# EAGLE schematic indicator_lights (EAGLE 7.2.0)
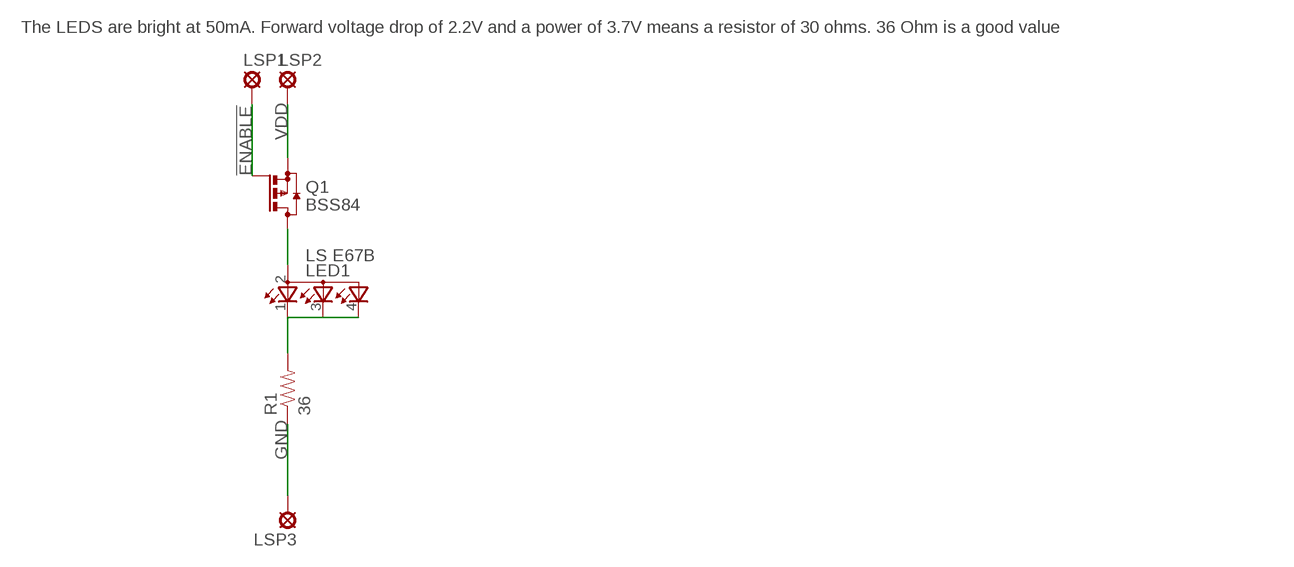
[diagram p0: schematic, sheet 1]

## Parts
LED1  LS E67B  TOPLED-3  [P-LCC-4-3]
LSP1  MCS10B  [MCS10B]
LSP2  MCS10B  [MCS10B]
LSP3  MCS10B  [MCS10B]
Q1  BSS84  [SOT23]
R1  36  RESISTOR0603-RES  [0603-RES]

## Nets
!ENABLE: LSP1.MP Q1.1(G)
GND: LSP3.MP R1.1
N$1: LED1.2(A2) Q1.3(D)
N$2: LED1.1(CRED) LED1.3(CBLUE) LED1.4(CGREEN) R1.2
VDD: LSP2.MP Q1.2(S)

## Notes on the sheet
- The LEDS are bright at 50mA. Forward voltage drop of 2.2V and a power of 3.7V means a resistor of 30 ohms. 36 Ohm is a good value

## Library data of the parts
LED1 = led:TOPLED-3: OSRAM - Hyper Multi TOPLED® (RGB) LB E673, LV E673, LT E673 - Power TOPLED® Enhanced optical Power LED (HOP2000) LS E67B, LA E67B, LO E67B, LY E67B - Hyper Multi TOPLED® Enhanced optical Power LED (HOP2000 / ATON®) LATB T66B - Hyper Multi TOPLED® Hyper-Bright LED LATB T686 Source: http://www.osram.convergy.de/
LSP1-LSP3 = solpad:MCS10B: SOLDER PAD MC S1, distributor Buerklin, 15F505
Q1 = transistor-small-signal:BSS84: P-CHANNEL MOS FET
R1 = SparkFun-Passives:RESISTOR: Resistor Basic schematic elements and footprints for 0603, 1206, and PTH resistors.